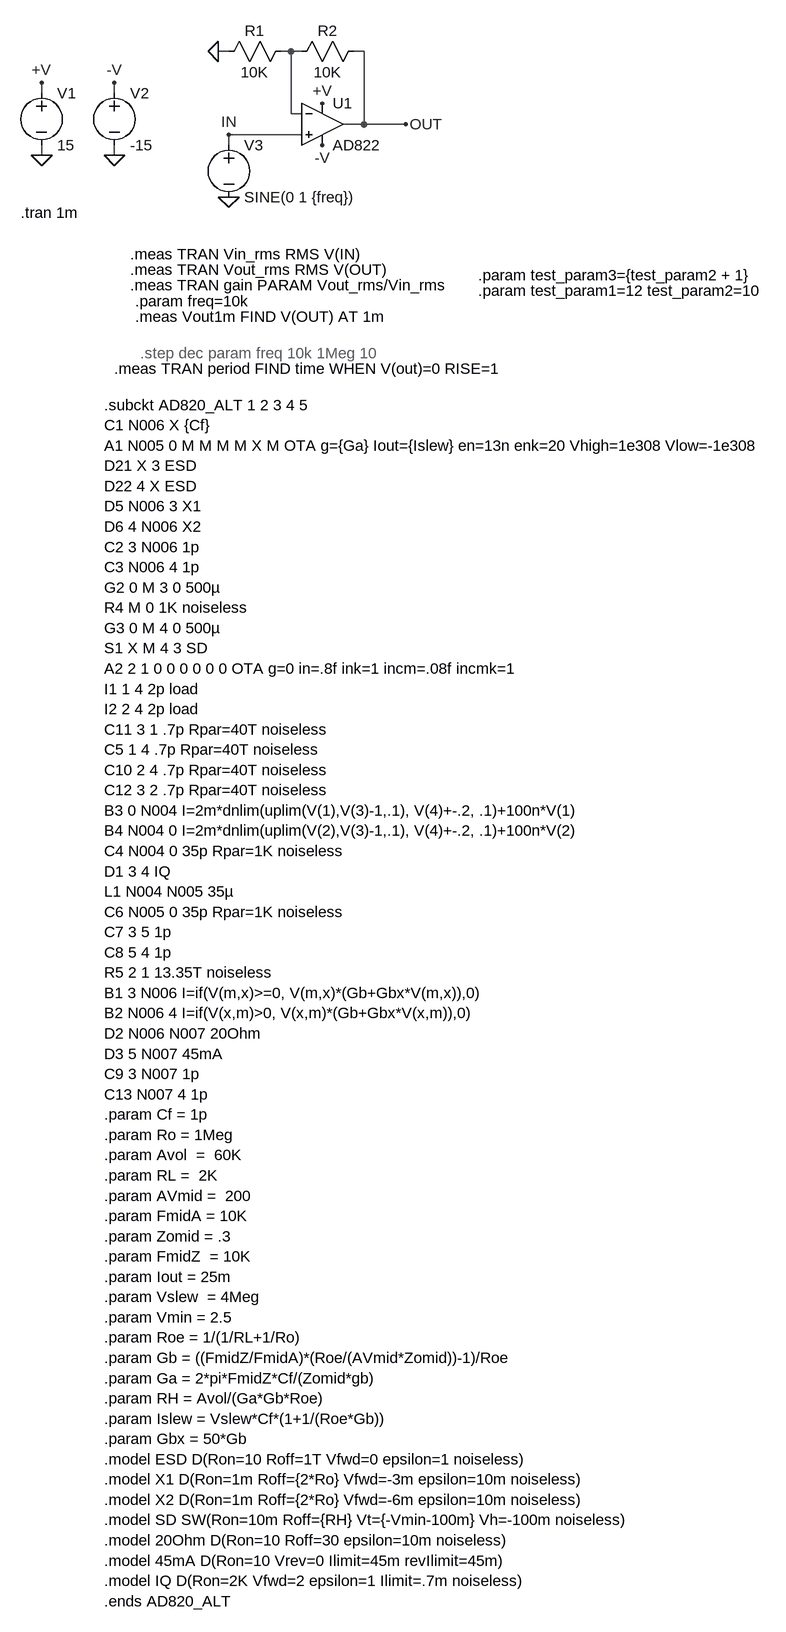
[diagram p0: schematic Batch_Test.asc]
Batch_Test.asc, the LTspice schematic file:
Version 4.1
SHEET 1 2320 1456
WIRE 432 -1216 416 -1216
WIRE 528 -1216 512 -1216
WIRE 544 -1216 528 -1216
WIRE 640 -1216 624 -1216
WIRE 144 -1152 144 -1168
WIRE 256 -1152 256 -1168
WIRE 528 -1120 528 -1216
WIRE 544 -1120 528 -1120
WIRE 640 -1104 640 -1216
WIRE 640 -1104 608 -1104
WIRE 704 -1104 640 -1104
WIRE 544 -1088 432 -1088
WIRE 432 -1072 432 -1088
WIRE 144 -1056 144 -1072
WIRE 256 -1056 256 -1072
FLAG 144 -1168 +V
FLAG 144 -1056 0
FLAG 704 -1104 OUT
FLAG 432 -1088 IN
FLAG 576 -1136 +V
FLAG 256 -1168 -V
FLAG 576 -1072 -V
FLAG 416 -1216 0
FLAG 256 -1056 0
FLAG 432 -992 0
SYMBOL voltage 144 -1168 R0
WINDOW 123 0 0 Left 2
WINDOW 39 0 0 Left 2
SYMATTR InstName V1
SYMATTR Value 15
SYMBOL res 528 -1232 R90
WINDOW 0 0 56 VBottom 2
WINDOW 3 32 56 VTop 2
SYMATTR InstName R1
SYMATTR Value 10K
SYMBOL res 640 -1232 R90
WINDOW 0 0 56 VBottom 2
WINDOW 3 32 56 VTop 2
SYMATTR InstName R2
SYMATTR Value 10K
SYMBOL voltage 256 -1168 R0
WINDOW 123 24 146 Left 2
WINDOW 39 24 125 Left 2
SYMATTR InstName V2
SYMATTR Value -15
SYMBOL voltage 432 -1088 R0
WINDOW 123 0 0 Left 0
WINDOW 39 0 0 Left 0
SYMATTR InstName V3
SYMATTR Value SINE(0 1 {freq})
SYMBOL Opamps\\AD822 576 -1168 R0
SYMATTR InstName U1
TEXT 112 -968 Left 2 !.tran 1m
TEXT 280 -880 Left 2 !.meas TRAN Vout_rms RMS V(OUT)
TEXT 280 -904 Left 2 !.meas TRAN Vin_rms RMS V(IN)
TEXT 280 -856 Left 2 !.meas TRAN gain PARAM Vout_rms/Vin_rms
TEXT 288 -832 Left 2 !.param freq=10k
TEXT 288 -808 Left 2 !.meas Vout1m FIND V(OUT) AT 1m
TEXT 256 -728 Left 2 !.meas TRAN period FIND time WHEN V(out)=0 RISE=1
TEXT 816 -872 Left 2 !.param test_param3={test_param2 + 1}
TEXT 816 -848 Left 2 !.param test_param1=12 test_param2=10
TEXT 296 -752 Left 2 ;.step dec param freq 10k 1Meg 10
TEXT 240 -672 Left 2 !.subckt AD820_ALT 1 2 3 4 5\nC1 N006 X {Cf}\nA1 N005 0 M M M M X M OTA g={Ga} Iout={Islew} en=13n enk=20 Vhigh=1e308 Vlow=-1e308\nD21 X 3 ESD\nD22 4 X ESD\nD5 N006 3 X1\nD6 4 N006 X2\nC2 3 N006 1p\nC3 N006 4 1p\nG2 0 M 3 0 500µ\nR4 M 0 1K noiseless\nG3 0 M 4 0 500µ\nS1 X M 4 3 SD\nA2 2 1 0 0 0 0 0 0 OTA g=0 in=.8f ink=1 incm=.08f incmk=1\nI1 1 4 2p load\nI2 2 4 2p load\nC11 3 1 .7p Rpar=40T noiseless\nC5 1 4 .7p Rpar=40T noiseless\nC10 2 4 .7p Rpar=40T noiseless\nC12 3 2 .7p Rpar=40T noiseless\nB3 0 N004 I=2m*dnlim(uplim(V(1),V(3)-1,.1), V(4)+-.2, .1)+100n*V(1)\nB4 N004 0 I=2m*dnlim(uplim(V(2),V(3)-1,.1), V(4)+-.2, .1)+100n*V(2)\nC4 N004 0 35p Rpar=1K noiseless\nD1 3 4 IQ\nL1 N004 N005 35µ\nC6 N005 0 35p Rpar=1K noiseless\nC7 3 5 1p\nC8 5 4 1p\nR5 2 1 13.35T noiseless\nB1 3 N006 I=if(V(m,x)>=0, V(m,x)*(Gb+Gbx*V(m,x)),0)\nB2 N006 4 I=if(V(x,m)>0, V(x,m)*(Gb+Gbx*V(x,m)),0)\nD2 N006 N007 20Ohm\nD3 5 N007 45mA\nC9 3 N007 1p\nC13 N007 4 1p\n.param Cf = 1p\n.param Ro = 1Meg\n.param Avol  =  60K\n.param RL =  2K\n.param AVmid =  200\n.param FmidA = 10K\n.param Zomid = .3\n.param FmidZ  = 10K\n.param Iout = 25m\n.param Vslew  = 4Meg\n.param Vmin = 2.5\n.param Roe = 1/(1/RL+1/Ro)\n.param Gb = ((FmidZ/FmidA)*(Roe/(AVmid*Zomid))-1)/Roe\n.param Ga = 2*pi*FmidZ*Cf/(Zomid*gb)\n.param RH = Avol/(Ga*Gb*Roe)\n.param Islew = Vslew*Cf*(1+1/(Roe*Gb))\n.param Gbx = 50*Gb\n.model ESD D(Ron=10 Roff=1T Vfwd=0 epsilon=1 noiseless)\n.model X1 D(Ron=1m Roff={2*Ro} Vfwd=-3m epsilon=10m noiseless)\n.model X2 D(Ron=1m Roff={2*Ro} Vfwd=-6m epsilon=10m noiseless)\n.model SD SW(Ron=10m Roff={RH} Vt={-Vmin-100m} Vh=-100m noiseless)\n.model 20Ohm D(Ron=10 Roff=30 epsilon=10m noiseless)\n.model 45mA D(Ron=10 Vrev=0 Ilimit=45m revIlimit=45m)\n.model IQ D(Ron=2K Vfwd=2 epsilon=1 Ilimit=.7m noiseless)\n.ends AD820_ALT

The netlist it stands for:
* Batch_Test.asc
V1 +V 0 15
R1 N001 0 10K
R2 OUT N001 10K
V2 -V 0 -15
V3 IN 0 SINE(0 1 {freq})
X§U1 IN N001 +V -V OUT AD822  ; pins In+ In- V+ V- OUT
.tran 1m
.meas TRAN Vout_rms RMS V(OUT)
.meas TRAN Vin_rms RMS V(IN)
.meas TRAN gain PARAM Vout_rms/Vin_rms
.param freq=10k
.meas Vout1m FIND V(OUT) AT 1m
.meas TRAN period FIND time WHEN V(out)=0 RISE=1
.param test_param3={test_param2 + 1}
.param test_param1=12 test_param2=10
* .step dec param freq 10k 1Meg 10
.subckt AD820_ALT 1 2 3 4 5
C1 N006 X {Cf}
A1 N005 0 M M M M X M OTA g={Ga} Iout={Islew} en=13n enk=20 Vhigh=1e308 Vlow=-1e308
D21 X 3 ESD
D22 4 X ESD
D5 N006 3 X1
D6 4 N006 X2
C2 3 N006 1p
C3 N006 4 1p
G2 0 M 3 0 500µ
R4 M 0 1K noiseless
G3 0 M 4 0 500µ
S1 X M 4 3 SD
A2 2 1 0 0 0 0 0 0 OTA g=0 in=.8f ink=1 incm=.08f incmk=1
I1 1 4 2p load
I2 2 4 2p load
C11 3 1 .7p Rpar=40T noiseless
C5 1 4 .7p Rpar=40T noiseless
C10 2 4 .7p Rpar=40T noiseless
C12 3 2 .7p Rpar=40T noiseless
B3 0 N004 I=2m*dnlim(uplim(V(1),V(3)-1,.1), V(4)+-.2, .1)+100n*V(1)
B4 N004 0 I=2m*dnlim(uplim(V(2),V(3)-1,.1), V(4)+-.2, .1)+100n*V(2)
C4 N004 0 35p Rpar=1K noiseless
D1 3 4 IQ
L1 N004 N005 35µ
C6 N005 0 35p Rpar=1K noiseless
C7 3 5 1p
C8 5 4 1p
R5 2 1 13.35T noiseless
B1 3 N006 I=if(V(m,x)>=0, V(m,x)*(Gb+Gbx*V(m,x)),0)
B2 N006 4 I=if(V(x,m)>0, V(x,m)*(Gb+Gbx*V(x,m)),0)
D2 N006 N007 20Ohm
D3 5 N007 45mA
C9 3 N007 1p
C13 N007 4 1p
.param Cf = 1p
.param Ro = 1Meg
.param Avol  =  60K
.param RL =  2K
.param AVmid =  200
.param FmidA = 10K
.param Zomid = .3
.param FmidZ  = 10K
.param Iout = 25m
.param Vslew  = 4Meg
.param Vmin = 2.5
.param Roe = 1/(1/RL+1/Ro)
.param Gb = ((FmidZ/FmidA)*(Roe/(AVmid*Zomid))-1)/Roe
.param Ga = 2*pi*FmidZ*Cf/(Zomid*gb)
.param RH = Avol/(Ga*Gb*Roe)
.param Islew = Vslew*Cf*(1+1/(Roe*Gb))
.param Gbx = 50*Gb
.model ESD D(Ron=10 Roff=1T Vfwd=0 epsilon=1 noiseless)
.model X1 D(Ron=1m Roff={2*Ro} Vfwd=-3m epsilon=10m noiseless)
.model X2 D(Ron=1m Roff={2*Ro} Vfwd=-6m epsilon=10m noiseless)
.model SD SW(Ron=10m Roff={RH} Vt={-Vmin-100m} Vh=-100m noiseless)
.model 20Ohm D(Ron=10 Roff=30 epsilon=10m noiseless)
.model 45mA D(Ron=10 Vrev=0 Ilimit=45m revIlimit=45m)
.model IQ D(Ron=2K Vfwd=2 epsilon=1 Ilimit=.7m noiseless)
.ends AD820_ALT
.backanno
.end